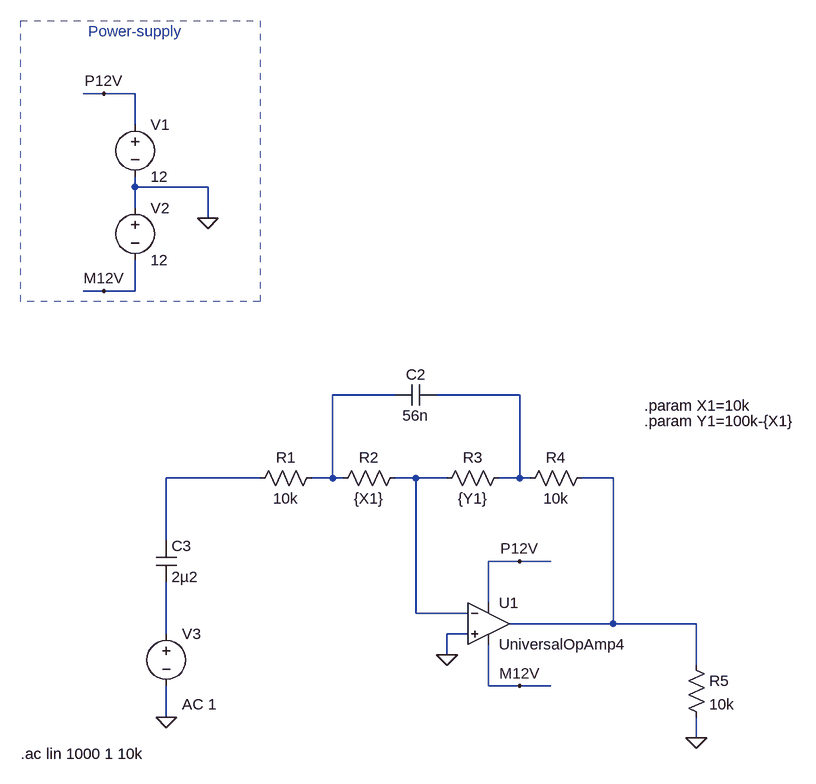
[diagram p0: schematic 3_band_eq_single_stage_fr.asc]
3_band_eq_single_stage_fr.asc, the LTspice schematic file:
Version 4
SHEET 1 1516 680
WIRE 416 -400 384 -400
WIRE 464 -400 416 -400
WIRE 464 -352 464 -400
WIRE 464 -256 464 -272
WIRE 576 -256 464 -256
WIRE 464 -224 464 -256
WIRE 576 -208 576 -256
WIRE 416 -96 384 -96
WIRE 464 -96 464 -144
WIRE 464 -96 416 -96
WIRE 864 64 768 64
WIRE 1056 64 928 64
WIRE 656 192 512 192
WIRE 768 192 768 64
WIRE 768 192 736 192
WIRE 784 192 768 192
WIRE 896 192 864 192
WIRE 944 192 896 192
WIRE 1056 192 1056 64
WIRE 1056 192 1024 192
WIRE 1072 192 1056 192
WIRE 1200 192 1152 192
WIRE 512 288 512 192
WIRE 1056 320 1008 320
WIRE 1104 320 1056 320
WIRE 1008 384 1008 320
WIRE 896 400 896 192
WIRE 976 400 896 400
WIRE 1200 416 1200 192
WIRE 1200 416 1040 416
WIRE 1328 416 1200 416
WIRE 512 432 512 352
WIRE 976 432 944 432
WIRE 944 464 944 432
WIRE 1328 480 1328 416
WIRE 1008 512 1008 448
WIRE 1056 512 1008 512
WIRE 1104 512 1056 512
WIRE 512 560 512 512
WIRE 1328 592 1328 560
FLAG 576 -208 0
FLAG 416 -400 P12V
FLAG 416 -96 M12V
FLAG 512 560 0
FLAG 944 464 0
FLAG 1328 592 0
FLAG 1056 320 P12V
FLAG 1056 512 M12V
SYMBOL voltage 464 -368 R0
WINDOW 123 0 0 Left 0
WINDOW 39 0 0 Left 0
SYMATTR InstName V1
SYMATTR Value 12
SYMBOL voltage 464 -240 R0
WINDOW 123 0 0 Left 0
WINDOW 39 0 0 Left 0
SYMATTR InstName V2
SYMATTR Value 12
SYMBOL voltage 512 416 R0
WINDOW 123 24 124 Left 2
WINDOW 39 0 0 Left 0
SYMATTR Value2 AC 1
SYMATTR InstName V3
SYMATTR Value ""
SYMBOL OpAmps\\UniversalOpAmp4 1008 416 R0
SYMATTR InstName U1
SYMBOL res 752 176 R90
WINDOW 0 0 56 VBottom 2
WINDOW 3 32 56 VTop 2
SYMATTR InstName R1
SYMATTR Value 10k
SYMBOL res 880 176 R90
WINDOW 0 0 56 VBottom 2
WINDOW 3 32 56 VTop 2
SYMATTR InstName R2
SYMATTR Value {X1}
SYMBOL res 1040 176 R90
WINDOW 0 0 56 VBottom 2
WINDOW 3 32 56 VTop 2
SYMATTR InstName R3
SYMATTR Value {Y1}
SYMBOL res 1168 176 R90
WINDOW 0 0 56 VBottom 2
WINDOW 3 32 56 VTop 2
SYMATTR InstName R4
SYMATTR Value 10k
SYMBOL cap 928 48 R90
WINDOW 0 0 32 VBottom 2
WINDOW 3 32 32 VTop 2
SYMATTR InstName C2
SYMATTR Value 56n
SYMBOL res 1312 464 R0
SYMATTR InstName R5
SYMATTR Value 10k
SYMBOL cap 496 288 R0
SYMATTR InstName C3
SYMATTR Value 2µ2
TEXT 392 -496 Left 2 ;Power-supply
TEXT 1248 80 Left 2 !.param X1=10k
TEXT 1248 104 Left 2 !.param Y1=100k-{X1}
TEXT 288 616 Left 2 !.ac lin 1000 1 10k
RECTANGLE Normal 656 -80 288 -512 2

The netlist it stands for:
* 3_band_eq_single_stage_fr.asc
V1 P12V 0 12
V2 0 M12V 12
V3 N006 0 AC 1
* U1: UniversalOpAmp4 (symbol OpAmps\UniversalOpAmp4 not available, pins judged from their places): In+=0 In-=N004 V+=P12V V-=M12V OUT=N005
R1 N001 N003 10k
R2 N004 N001 {X1}
R3 N002 N004 {Y1}
R4 N005 N002 10k
C2 N002 N001 56n
R5 N005 0 10k
C3 N003 N006 2µ2
* Power-supply
.param X1=10k
.param Y1=100k-{X1}
.ac lin 1000 1 10k
.backanno
.end